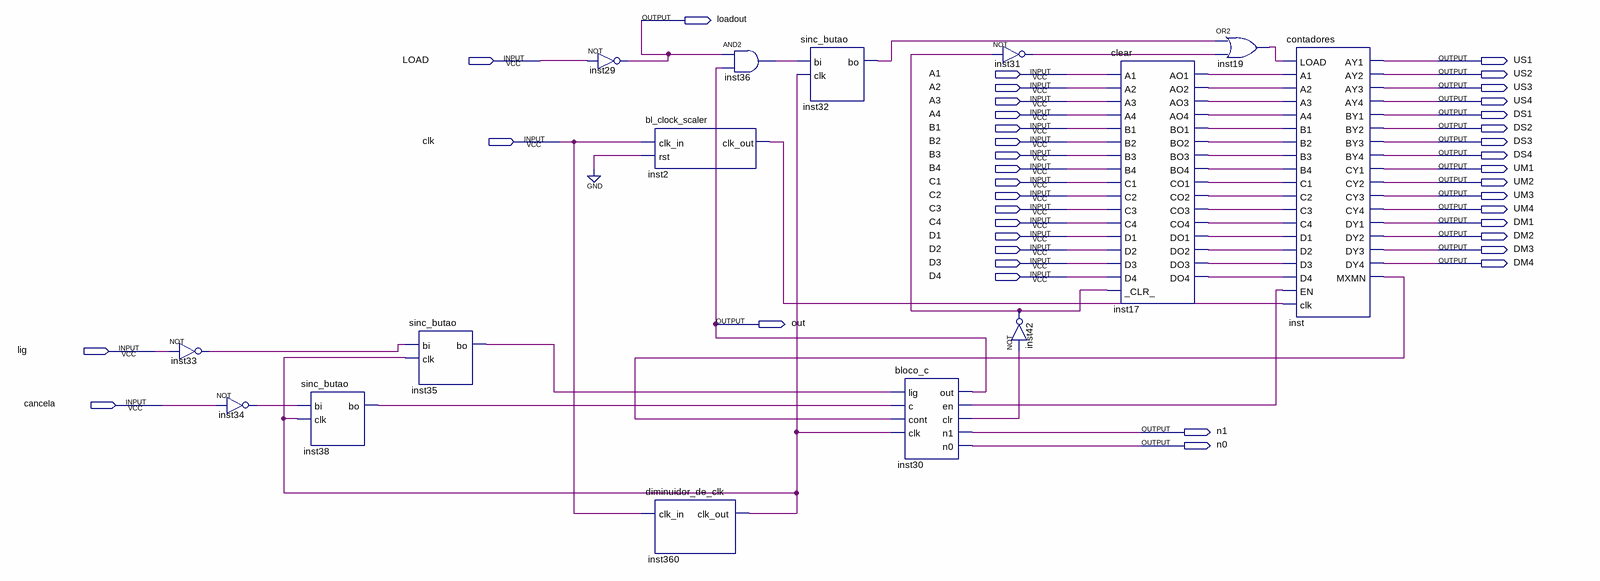
[diagram p0: schematic sheet]
// Quartus schematic TimerTop.bdf as structural Verilog: 15 symbols, 40 pins
module TimerTop (
  input  LOAD,
  input  A1,
  input  A2,
  input  A3,
  input  A4,
  input  B1,
  input  clk,
  input  B2,
  input  B3,
  input  B4,
  input  C1,
  input  C2,
  input  C3,
  input  C4,
  input  D1,
  input  D2,
  input  D3,
  input  D4,
  input  lig,
  input  cancela,
  output loadout,
  output US1,
  output US2,
  output US3,
  output US4,
  output DS1,
  output DS2,
  output DS3,
  output DS4,
  output UM1,
  output UM2,
  output UM3,
  output UM4,
  output DM1,
  output DM2,
  output DM3,
  output DM4,
  output out,
  output n1,
  output n0
);

  wire inst2_clk_out, inst17_ao1, inst17_ao2, inst17_ao3, inst17_ao4, inst17_bo1, inst17_bo2, inst17_bo3,
       inst17_bo4, inst17_co1, inst17_co2, inst17_co3, inst17_co4, inst17_do1, inst17_do2, inst17_do3,
       inst17_do4, inst19_out, inst30_clr, inst30_en, inst31_out, inst32_bo, inst33_out, inst34_out,
       inst35_bo, inst36_out, inst38_bo, inst42_out, inst360_clk_out, inst_mxmn;

  not inst33 (inst33_out, lig);
  not inst34 (inst34_out, cancela);
  sinc_butao inst38 (.bi(inst34_out), .clk(inst360_clk_out), .bo(inst38_bo));
  sinc_butao inst35 (.bi(inst33_out), .clk(inst360_clk_out), .bo(inst35_bo));
  not inst29 (loadout, LOAD);
  bl_clock_scaler inst2 (.clk_in(clk), .rst(1'b0), .clk_out(inst2_clk_out));
  diminuidor_de_clk inst360 (.clk_in(clk), .clk_out(inst360_clk_out));
  and inst36 (inst36_out, loadout, out);
  sinc_butao inst32 (.bi(inst36_out), .clk(inst360_clk_out), .bo(inst32_bo));
  bloco_c inst30 (
    .lig(inst35_bo), .c(inst38_bo), .cont(inst_mxmn), .clk(inst360_clk_out), .out(out), .en(inst30_en),
    .clr(inst30_clr), .n1(n1), .n0(n0));
  not inst31 (inst31_out, inst42_out);
  not inst42 (inst42_out, inst30_clr);
  clear inst17 (
    .A1(A1), .A2(A2), .A3(A3), .A4(A4), .B1(B1), .B2(B2), .B3(B3), .B4(B4), .C1(C1), .C2(C2), .C3(C3),
    .C4(C4), .D1(D1), .D2(D2), .D3(D3), .D4(D4), ._CLR_(inst42_out), .AO1(inst17_ao1), .AO2(inst17_ao2),
    .AO3(inst17_ao3), .AO4(inst17_ao4), .BO1(inst17_bo1), .BO2(inst17_bo2), .BO3(inst17_bo3),
    .BO4(inst17_bo4), .CO1(inst17_co1), .CO2(inst17_co2), .CO3(inst17_co3), .CO4(inst17_co4),
    .DO1(inst17_do1), .DO2(inst17_do2), .DO3(inst17_do3), .DO4(inst17_do4));
  or inst19 (inst19_out, inst32_bo, inst31_out);
  contadores inst (
    .LOAD(inst19_out), .A1(inst17_ao1), .A2(inst17_ao2), .A3(inst17_ao3), .A4(inst17_ao4), .B1(inst17_bo1),
    .B2(inst17_bo2), .B3(inst17_bo3), .B4(inst17_bo4), .C1(inst17_co1), .C2(inst17_co2), .C3(inst17_co3),
    .C4(inst17_co4), .D1(inst17_do1), .D2(inst17_do2), .D3(inst17_do3), .D4(inst17_do4), .EN(inst30_en),
    .clk(inst2_clk_out), .AY1(US1), .AY2(US2), .AY3(US3), .AY4(US4), .BY1(DS1), .BY2(DS2), .BY3(DS3),
    .BY4(DS4), .CY1(UM1), .CY2(UM2), .CY3(UM3), .CY4(UM4), .DY1(DM1), .DY2(DM2), .DY3(DM3), .DY4(DM4),
    .MXMN(inst_mxmn));
endmodule
